# Altium schematic sheet Sheet1.SchDoc
size A
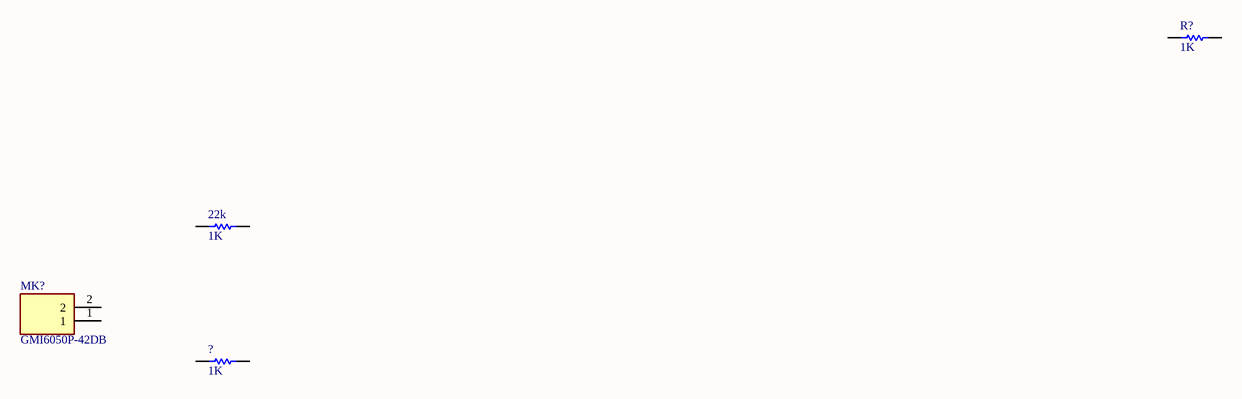
[diagram p0: Sheet1.SchDoc]

## Parts
22k  value 1K  (hidden comment: Resistor)
?  value 1K  (hidden comment: Resistor)
MK?  GMI6050P-42DB  [GMI6050P42DB]
R?  value 1K  (hidden comment: Resistor)

## Nets

Not connected (* = marked no-connect by the designer): 22k 1 2; ? 1 2; MK? 1 2; R? 1 2

## Library data of the parts
22k ? R? = Resistor: TC1: 0; SimulationGenericComponent: True; TC2: 0
MK? = GMI6050P-42DB: Microphone; Manufacturer_Name: INGHAi; Datasheet Link: https://datasheet.lcsc.com/szlcsc/1810191428_INGHAi-GMI6050P-42db_C233942.pdf; Height: 5.2mm; Manufacturer_Part_Number: GMI6050P-42DB